# Altium project MPU.PrjPCB
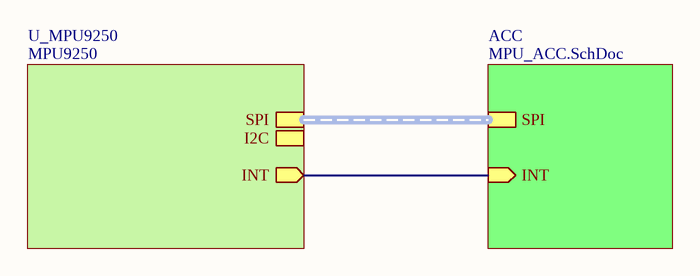
[diagram p0: MPU.SchDoc]
2 sheets, 1 parts. Net scope: hierarchical (ports join the sheet entries above them; power ports are global).
Board file: MPU.PcbDoc
Sheets:
  MPU.SchDoc
    ACC = MPU_ACC.SchDoc

## Sheet MPU.SchDoc
size A4

### Sub-sheets
ACC = MPU_ACC.SchDoc: SPI, INT (in)
U_MPU9250 = MPU9250 (file not in this document): INT (out), SPI (harness SPI), I2C (harness SPI)

### Nets
NetP1_1: sheet ACC/INT, sheet U_MPU9250/INT

### Buses and harness runs
harness sheet ACC/SPI = sheet U_MPU9250/SPI

## Sheet MPU_ACC.SchDoc
size A4
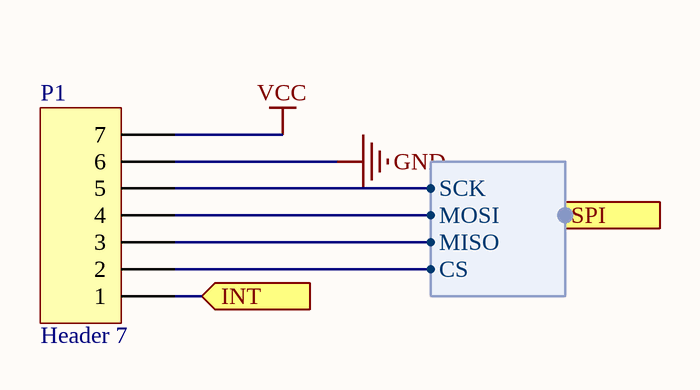
[diagram p1: MPU_ACC.SchDoc]

### Parts
P1  Header 7  [HDR1X7]

### Ports
INT (in), SPI (harness SPI)

### Harnesses
SPI: SCK, MOSI, MISO, CS

### Nets
GND: P1.6
VCC: P1.7
NetP1_1: P1.1 ; port INT
NetP1_2: P1.2 ; port SPI.CS
NetP1_3: P1.3 ; port SPI.MISO
NetP1_4: P1.4 ; port SPI.MOSI
NetP1_5: P1.5 ; port SPI.SCK

### Library data of the parts
P1 = Header 7: Header, 7-Pin; LatestRevisionDate: 17-Jul-2002; LatestRevisionNote: Re-released for DXP Platform.; Publisher: Altium Limited